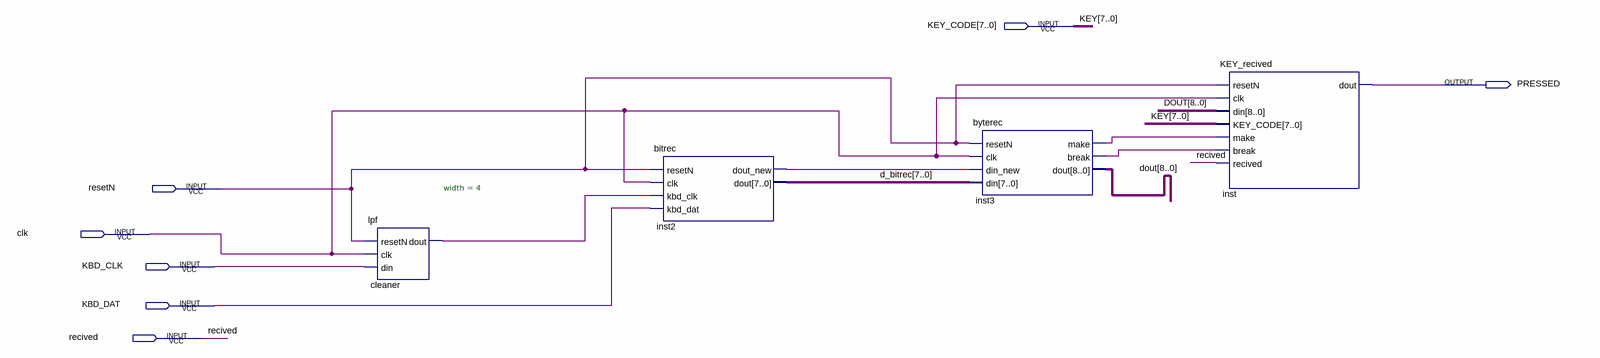
[diagram p0: schematic sheet]
// Quartus schematic KEY_NOTE_3.bdf as structural Verilog: 4 symbols, 7 pins
module KEY_NOTE_3 (
  input  [7:0] KEY_CODE,
  input  resetN,
  input  clk,
  input  KBD_CLK,
  input  KBD_DAT,
  input  recived,
  output PRESSED
);

  wire cleaner_dout, inst2_dout_new, inst3_break, inst3_make;
  wire [7:0] d_bitrec;
  wire [8:0] dout;

  lpf #(.width(4)) cleaner (.resetN(resetN), .clk(clk), .din(KBD_CLK), .dout(cleaner_dout));
  bitrec inst2 (
    .resetN(resetN), .clk(clk), .kbd_clk(cleaner_dout), .kbd_dat(KBD_DAT), .dout_new(inst2_dout_new),
    .dout(d_bitrec));
  byterec inst3 (
    .resetN(resetN), .clk(clk), .din_new(inst2_dout_new), .din(d_bitrec), .make(inst3_make),
    .\break (inst3_break), .dout(dout));
  KEY_recived inst (
    .resetN(resetN), .clk(clk), .din(dout), .KEY_CODE(KEY_CODE), .make(inst3_make), .\break (inst3_break),
    .recived(recived), .dout(PRESSED));

  // Other names for the same wires on the sheet: KEY[7:0] = KEY_CODE
endmodule
